# Altium schematic sheet Nixie_MCU_PWR.SchDoc
size 420 x 297 mm; Date: 07.02.20; SheetNumber: 2; Title1str: {Наименование}; PageSetup: Record=PageOptions|CenterHorizontal=False|CenterVertical=False|PrintScale=0.95|XCorrection=0.00|YCorrection=0.00|PrintKind=1|BorderSize=5000000|LeftOffset=0|BottomOffset=0|Orientation=1|PaperLength=1000|PaperWidth=1000|Scale=100|PaperSource=15|PrintQuality=600|MediaType=1|DitherType=10|PaperKind=A4|PrintScaleMode=1; Title2str: {Наименование}; DocumentType: {Документ}; DocumentType1str: {Документ}; DocumentType2str: {Документ}
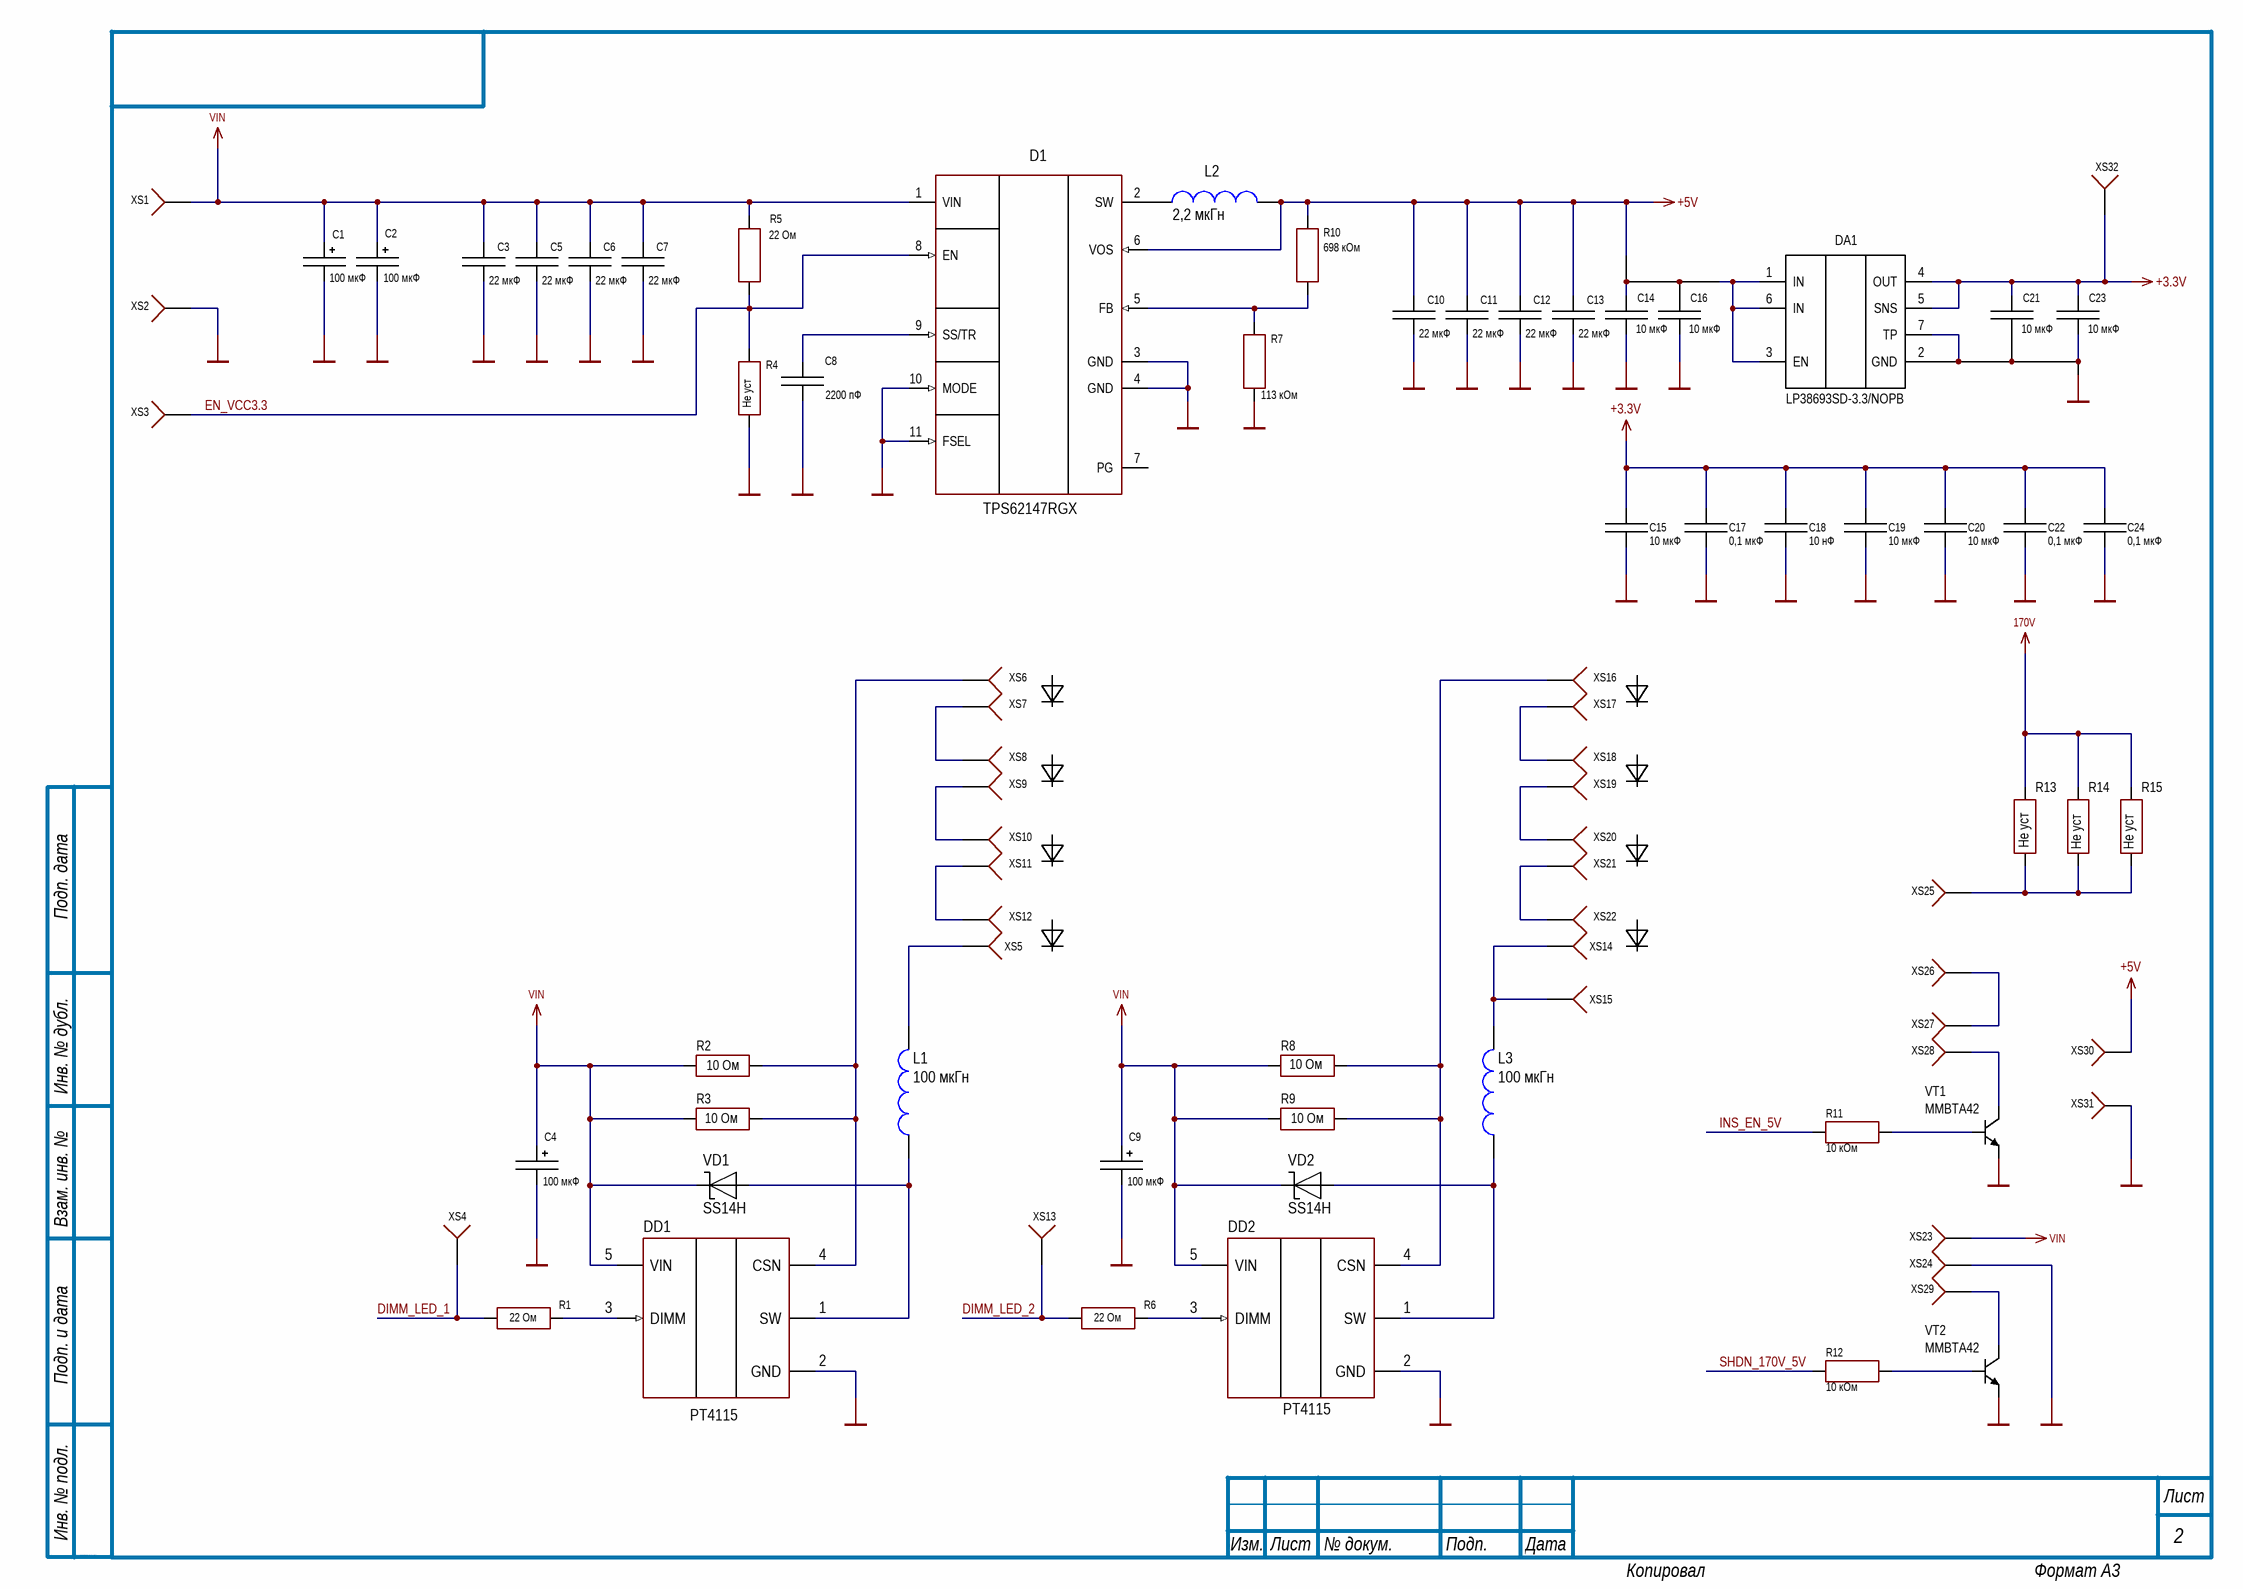
[diagram p0: Nixie_MCU_PWR.SchDoc]

## Parts
C1  value 100 мкФ  [CAP: D5H5.8]
C2  value 100 мкФ  [CAP: D5H5.8]
C3  value 22 мкФ  [CAP: 0805R]
C4  value 100 мкФ  [CAP: D5H5.8]
C5  value 22 мкФ  [CAP: 0805R]
C6  value 22 мкФ  [CAP: 0805R]
C7  value 22 мкФ  [CAP: 0805R]
C8  value 2200 пФ  [CAP: 0402R]
C9  value 100 мкФ  [CAP: D5H5.8]
C10  value 22 мкФ  [CAP: 0805R]
C11  value 22 мкФ  [CAP: 0805R]
C12  value 22 мкФ  [CAP: 0805R]
C13  value 22 мкФ  [CAP: 0805R]
C14  value 10 мкФ  [CAP: 0603R]
C15  value 10 мкФ  [CAP: 0603R]
C16  value 10 мкФ  [CAP: 0603R]
C17  value 0,1 мкФ  [CAP: 0402R]
C18  value 10 нФ  [CAP: 0402R]
C19  value 10 мкФ  [CAP: 0603R]
C20  value 10 мкФ  [CAP: 0603R]
C21  value 10 мкФ  [CAP: 0603R]
C22  value 0,1 мкФ  [CAP: 0402R]
C23  value 10 мкФ  [CAP: 0603R]
C24  value 0,1 мкФ  [CAP: 0402R]
D1  (no value)  [11-VQFN(RGX)]
DA1  LP38693SD-3.3/NOPB  [6-WSON]
DD1  (no value)  [5-SOT-89]
DD2  (no value)  [5-SOT-89]
L1  value 100 мкГн  [IND: VLS5045EX]
L2  value 2,2 мкГн  [IND: VLS5045EX]
L3  value 100 мкГн  [IND: VLS5045EX]
R1  value 22 Ом  [RES: 0402_ASK]
R2  value 10 Ом  [RES: 0603_ASK]
R3  value 10 Ом  [RES: 0603_ASK]
R4  value Не уст  [RES: 0402_ASK]
R5  value 22 Ом  [RES: 0402_ASK]
R6  value 22 Ом  [RES: 0402_ASK]
R7  value 113 кОм  [RES: 0402_ASK]
R8  value 10 Ом  [RES: 0603_ASK]
R9  value 10 Ом  [RES: 0603_ASK]
R10  value 698 кОм  [RES: 0402_ASK]
R11  value 10 кОм  [RES: 0402_ASK]
R12  value 10 кОм  [RES: 0402_ASK]
R13  value Не уст  [RES: 0603_ASK]
R14  value Не уст  [RES: 0603_ASK]
R15  value Не уст  [RES: 0603_ASK]
VD1  PartNumber: SS14H  [DIODE: SMA]
VD2  PartNumber: SS14H  [DIODE: SMA]
VT1  PartNumber: MMBTA42  [SOT23]
VT2  PartNumber: MMBTA42  [SOT23]
XS1  (no value)  [CON: PLD-1]
XS2  (no value)  [CON: PLD-1]
XS3  (no value)  [CON: PLD-1]
XS4  (no value)  [CON: PLD-1]
XS5  (no value)  [CON: PLD-1]
XS6  (no value)  [CON: PLD-1]
XS7  (no value)  [CON: PLD-1]
XS8  (no value)  [CON: PLD-1]
XS9  (no value)  [CON: PLD-1]
XS10  (no value)  [CON: PLD-1]
XS11  (no value)  [CON: PLD-1]
XS12  (no value)  [CON: PLD-1]
XS13  (no value)  [CON: PLD-1]
XS14  (no value)  [CON: PLD-1]
XS15  (no value)  [CON: PLD-1]
XS16  (no value)  [CON: PLD-1]
XS17  (no value)  [CON: PLD-1]
XS18  (no value)  [CON: PLD-1]
XS19  (no value)  [CON: PLD-1]
XS20  (no value)  [CON: PLD-1]
XS21  (no value)  [CON: PLD-1]
XS22  (no value)  [CON: PLD-1]
XS23  (no value)  [CON: PLD-1]
XS24  (no value)  [CON: PLD-1]
XS25  (no value)  [CON: PLD-1]
XS26  (no value)  [CON: PLD-1]
XS27  (no value)  [CON: PLD-1]
XS28  (no value)  [CON: PLD-1]
XS29  (no value)  [CON: PLD-1]
XS30  (no value)  [CON: PLD-1]
XS31  (no value)  [CON: PLD-1]
XS32  (no value)  [CON: PLD-1]

## Nets
170V: R13.2 R14.2 R15.2
+3.3V: C15.2 C17.2 C18.2 C19.2 C20.2 C21.2 C22.2 C23.2 C24.2 DA1.4(OUT) DA1.5(SNS) XS32.1
+5V: C10.2 C11.2 C12.2 C13.2 C14.2 C16.2 D1.6(VOS) DA1.1(IN) DA1.3(EN) DA1.6(IN) L2.2 R10.1 XS30.1
GND: C1.2 C2.2 C3.1 C4.2 C5.1 C6.1 C7.1 C8.1 C9.2 C10.1 C11.1 C12.1 C13.1 C14.1 C15.1 C16.1 C17.1 C18.1 C19.1 C20.1 C21.1 C22.1 C23.1 C24.1 D1.3(GND) D1.4(GND) D1.10(MODE) D1.11(FSEL) DA1.2(GND) DA1.7(TP) DD1.2(GND) DD2.2(GND) R4.2 R7.2 VT1.2(E) VT2.2(E) XS2.1 XS24.1 XS31.1
VIN: C1.1 C2.1 C3.2 C4.1 C5.2 C6.2 C7.2 C9.1 D1.1(VIN) DD1.5(VIN) DD2.5(VIN) R2.2 R3.2 R5.1 R8.2 R9.2 VD1.2 VD2.2 XS1.1 XS23.1
DIMM_LED_1: R1.1 XS4.1
DIMM_LED_2: R6.1 XS13.1
EN_VCC3.3: D1.8(EN) R4.1 R5.2 XS3.1
INS_EN_5V: R11.2
SHDN_170V_5V: R12.2
NetC8_2: C8.2 D1.9(SS/TR)
NetD1_2: D1.2(SW) L2.1
NetD1_5: D1.5(FB) R7.1 R10.2
NetDD1_1: DD1.1(SW) L1.1 VD1.1
NetDD1_3: DD1.3(DIMM) R1.2
NetDD1_4: DD1.4(CSN) R2.1 R3.1 XS6.1
NetDD2_1: DD2.1(SW) L3.1 VD2.1
NetDD2_3: DD2.3(DIMM) R6.2
NetDD2_4: DD2.4(CSN) R8.1 R9.1 XS16.1
NetL1_2: L1.2 XS5.1
NetL3_2: L3.2 XS14.1 XS15.1
NetR11_1: R11.1 VT1.1(B)
NetR12_1: R12.1 VT2.1(B)
NetR13_1: R13.1 R14.1 R15.1 XS25.1
NetVT1_3: VT1.3(C) XS28.1
NetVT2_3: VT2.3(C) XS29.1
NetXS7_1: XS7.1 XS8.1
NetXS9_1: XS9.1 XS10.1
NetXS11_1: XS11.1 XS12.1
NetXS17_1: XS17.1 XS18.1
NetXS19_1: XS19.1 XS20.1
NetXS21_1: XS21.1 XS22.1
NetXS26_1: XS26.1 XS27.1

Not connected (* = marked no-connect by the designer): D1 7(PG)

## Notes on the sheet
- Подп. дата
- Инв. № дубл.
- Взам. инв. №
- Подп. и дата
- Инв. № подл.
- Изм.
- Лист
- № докум.
- Подп.
- Дата
- ALTIUM GOSTBOM2.0 KEV
- Копировал
- Формат А3
- (in symbol LP38693SD-3.3/NOPB) STU

## Library data of the parts
C1 C2 C4 C9 = Aluminium: Manufacturer: Panasonic; PartNumber: EEE-FT1C101AR; TypeCapacitor: Aluminium capacitor; Tolerance: ±20%; Package: 5×5×5.3; HelpURL: https://www.compel.ru/infosheet/PAN/EEEFT1C101AR; ValueManufacturerPartNumber: =TypeCapacitor+', '+Value+', '+Voltage+', '+Tolerance+', '+Impedance+', '+Package+', '+Temperature; Temperature: -55...+105°C
C3 C5-C7 C10-C13 = Ceramic_0603: TypeCapacitor: Ceramic capacitor; Tolerance: ±20%; TypeDielectric: X5R; Volt: 25В; Перечень: 22 мкФ ±20%, 25В, X5R, 0805; Package: 0805; Temperature: -55...+125°C
C8 = Ceramic_0402: Manufacturer: Murata; TypeCapacitor: Ceramic capacitor; Tolerance: ± 10 %; TypeDielectric: X7R; Volt: 50 В; Перечень: 2200 пФ ± 10 %, 50 В, X7R, 0402; Package: 0402; ValueManufacturerPartNumber: =TypeCapacitor+', '+Value+', '+TypeDielectric+', '+Tolerance+', '+Voltage+', '+Package+', '+Temperature; Temperature: -55...+125°C
C14-C16 C19-C21 C23 = Ceramic_0603: Manufacturer: Yageo; ValueManufacturerPartNumber: Ceramic capacitor, 10 мкФ, X7R, ±10%, 16V, 0603, -55...+125°C; TypeCapacitor: Ceramic capacitor; Tolerance: ±10%; TypeDielectric: X7R; Voltage: 16V; Package: 0603; Temperature: -55...+125°C; Перечень: ="Value"+' '+"Tolerance"+', '+"Volt"+', '+"TypeDielectric"+',  '+"Package"
C17 C22 C24 = Ceramic_0402: Manufacturer: Murata; PartNumber: GCM155R71H104KE02#; TypeCapacitor: Ceramic capacitor; Tolerance: ± 10 %; TypeDielectric: X7R; Volt: 50 В; Перечень: 0,1 мкФ ± 10 %, 50 В, X7R, 0402; Package: 0402; ValueManufacturerPartNumber: =TypeCapacitor+', '+Value+', '+TypeDielectric+', '+Tolerance+', '+Voltage+', '+Package+', '+Temperature; Temperature: -55...+125°C
C18 = Ceramic_0402: Manufacturer: Murata; PartNumber: GCM155R71H104KE02#; TypeCapacitor: Ceramic capacitor; Tolerance: ± 10 %; TypeDielectric: X7R; Volt: 50 В; Перечень: 10 нФ ± 10 %, 50 В, X7R, 0402; Package: 0402; ValueManufacturerPartNumber: =TypeCapacitor+', '+Value+', '+TypeDielectric+', '+Tolerance+', '+Voltage+', '+Package+', '+Temperature; Temperature: -55...+125°C
D1 = TPS62147RGX: 3-V to 17-V 2-A Step-Down Converters; Manufacturer: Texas Instruments; ValueManufacturerPartNumber: DC/DC buck converter, 3 V to 17 V, 1.25 or 2.5MHz, 0.8 V to 12 V, 2A, -40...+85°C, 3-mm x 2-mm VQFN; VoltageInput: 3 V to 17 V; Frequency: 1.25 or 2.5MHz; CurrentOutput: 2A; VoltageOutput: 0.8 V to 12 V; HelpURL: https://pdf1.alldatasheet.com/datasheet-pdf/view/1031882/TI1/TPS62147RGXR.html; Package: 3-mm x 2-mm VQFN; ComponentType: DC/DC buck converter; Temperature: -40...+85°C; PartNumber: TPS62147RGX
DA1 = LP38693SD-3.3/NOPB: LINEAR 3.3V 500MA 6WSON; Manufacturer: Texas Instruments; ValueManufacturerPartNumber: LDO, (2.7 V to 10 V), , output 3.3V, 500 mA, -40…+125, WSON (6); VoltageInput: (2.7 V to 10 V); VoltageOutput: output 3.3V; HelpURL: http://www.ti.com/lit/ds/symlink/lp38693-q1.pdf; Package: WSON (6); ComponentType: LDO; Temperature: -40…+125; CurrentOutput: 500 mA; PartNumber: LP38693SD-3.3/NOPB; Перечень: LP38693SD-3.3/NOPB
DD1 DD2 = PT4115: LED current driver; VoltageInput: 6 V to 30 v; CurrentOutput: 1.2A; HelpURL: https://static.chipdip.ru/lib/848/DOC018848756.pdf; Package: SOT89-5; ComponentType: LED current driver; ValueManufacturerPartNumber: =ComponentType+', '+VoltageInput+', '+MaxDropout+', '+VoltageOutput+', '+CurrentOutput+', '+Temperature+', '+Package; Temperature: -40…+125; PartNumber: PT4115
L1 L3 = VLS5045EX: Power Inductor, 5.0x5.0x4.5mm, -40°C to +105°C; PartNumber: VLS5045EX-101M; ValueManufacturerPartNumber: Fixed inductor, 100 мкГн, , , , -40...+125°C; TypeInductor: Fixed inductor; Temperature: -40...+125°C
L2 = VLS5045EX: Power Inductor, 5.0x5.0x4.5mm, -40°C to +105°C; PartNumber: VLS5045EX-2R2N; ValueManufacturerPartNumber: Fixed inductor, 2,2 мкГн, , , , -40...+125°C; TypeInductor: Fixed inductor; Temperature: -40...+125°C
R1 R6 = Resistor_0402: PartNumber_book: Электроэлемент, резистор RC0402FR-0710KL; Перечень: 22 Ом ±1%, 0.063 Вт, 0402; TypeResistor: Resistor film; Power: 0.063 Вт; Tolerance: ±1%; Package: 0402; Temperature: -55...+125°C; ValueII: *; ValueIII: 0.063 Вт; Parameter 1: *
R2 R3 R8 R9 = Resistor_0603: Manufacturer: Yageo; PartNumber: RC0603JR-07100RL; ValueManufacturerPartNumber: Resistor film, 10 Ом, ±1%, 0603, 0.1W, -55...+125°C; TypeResistor: Resistor film; Power: 0.1W; Tolerance: ±1%; Package: 0603; HelpURL: https://www.digikey.com/product-detail/en/yageo/RC0603JR-07100RL/311-100GRCT-ND/729644; Temperature: -55...+125°C
R4 = Resistor_0402: Перечень: Не уст ±1%, 0.063 Вт, 0402; TypeResistor: Resistor film; Power: 0.063 Вт; Tolerance: ±1%; Package: 0402; Temperature: -55...+125°C; ValueII: *; ValueIII: 0.063 Вт; Parameter 1: *
R5 = Resistor_0402: Перечень: 22 Ом ±1%, 0.063 Вт, 0402; TypeResistor: Resistor film; Power: 0.063 Вт; Tolerance: ±1%; Package: 0402; Temperature: -55...+125°C; ValueII: *; ValueIII: 0.063 Вт; Parameter 1: *
R7 = Resistor_0402: Перечень: 113 кОм ±1%, 0.063 Вт, 0402; TypeResistor: Resistor film; Power: 0.063 Вт; Tolerance: ±1%; Package: 0402; Temperature: -55...+125°C; ValueII: *; ValueIII: 0.063 Вт; Parameter 1: *
R10 = Resistor_0402: Перечень: 698 кОм ±1%, 0.063 Вт, 0402; TypeResistor: Resistor film; Power: 0.063 Вт; Tolerance: ±1%; Package: 0402; Temperature: -55...+125°C; ValueII: *; ValueIII: 0.063 Вт; Parameter 1: *
R11 R12 = Resistor_0402: Перечень: 10 кОм ±1%, 0.063 Вт, 0402; TypeResistor: Resistor film; Power: 0.063 Вт; Tolerance: ±1%; Package: 0402; Temperature: -55...+125°C; ValueII: *; ValueIII: 0.063 Вт; Parameter 1: *
R13-R15 = Resistor_0603: Manufacturer: Yageo; PartNumber: RC0603JR-07100RL; ValueManufacturerPartNumber: Resistor film, Не уст, ±1%, 0603, 0.1W, -55...+125°C; TypeResistor: Resistor film; Power: 0.1W; Tolerance: ±1%; Package: 0603; HelpURL: https://www.digikey.com/product-detail/en/yageo/RC0603JR-07100RL/311-100GRCT-ND/729644; Temperature: -55...+125°C
VD1 VD2 = Schottky_single: Manufacturer: Diodes Incorporated; ValueManufacturerPartNumber: Schottky diode, 80V, 500mA, 1V, 15pF, SOD-123, -55...+150°C; TypeDiode: Schottky diode; Voltage: 80V; Current: 500mA; VoltageDrop: 1V; RecoveryTime: 15pF; Package: SOD-123; HelpURL: https://www.digikey.com/product-detail/en/diodes-incorporated/MBR0580S1-7/MBR0580S1-7DICT-ND/5080371; Temperature: -55...+150°C
VT1 VT2 = BJT_NPN_132: Manufacturer: ON Semiconductor; ValueManufacturerPartNumber: NPN transistor, 45V, 100mA, 100MHz, 300mW, 0.6V, 420, SOT-23, -55...+125°C; TypeTransistor: NPN transistor; VoltageCE: 45V; CurrentCE: 100mA; VoltageSaturation: 0.6V; Frequency: 100MHz; CurrentGain: 420; MaxPower: 300mW; Package: SOT-23; HelpURL: https://www.digikey.com/product-detail/en/on-semiconductor/BC847CLT1G/BC847CLT1GOSCT-ND/917836; Temperature: -55...+125°C
XS1-XS32 = Контр.точка: Перечень: Элемент платы; TypeConnector: Connector; CurrentMax: 3A; Multichannel: 1pin